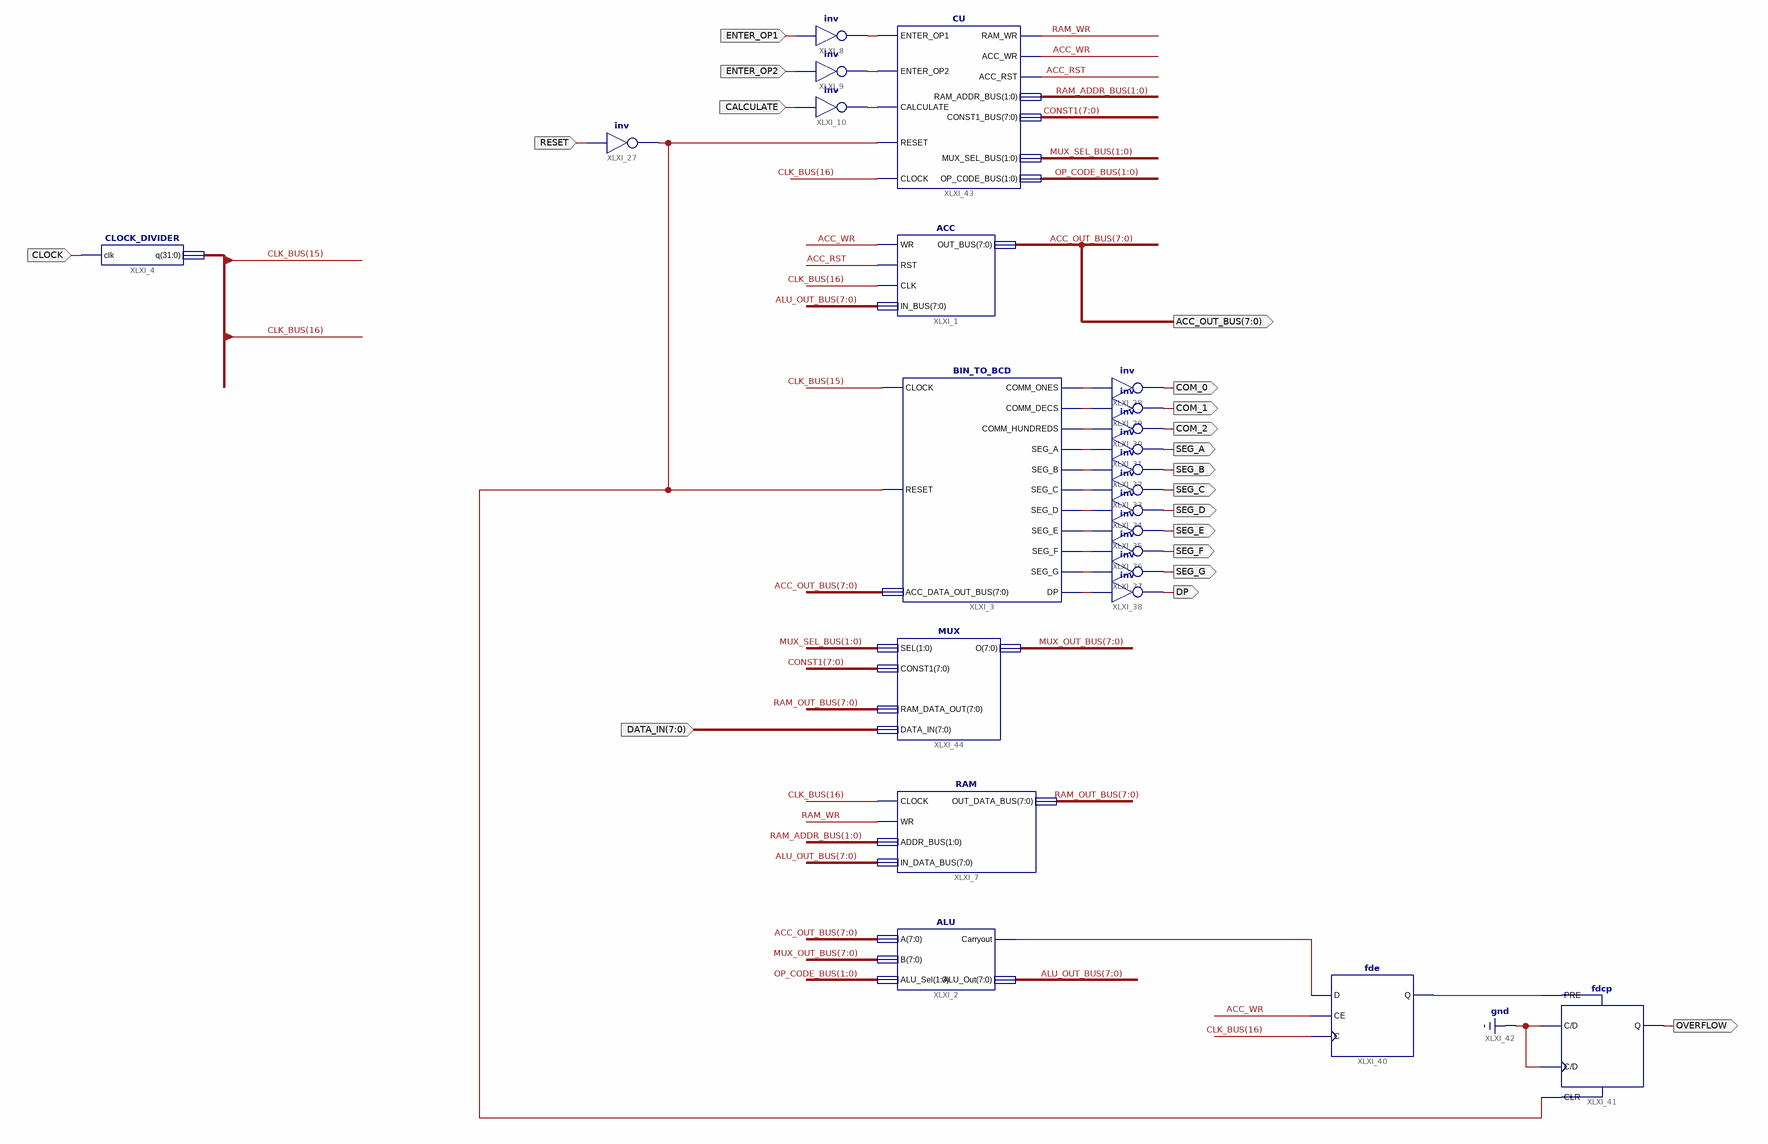
[diagram p0: schematic sheet 1]
// Xilinx ISE schematic TOP_SCHEME.sch (spartan3a) as structural Verilog: 24 symbols, 19 ports
module TOP_SCHEME (
  input  CLOCK,
  input  RESET,
  input  ENTER_OP1,
  input  ENTER_OP2,
  input  CALCULATE,
  input  [7:0] DATA_IN,
  output [7:0] ACC_OUT_BUS,
  output COM_0,
  output COM_1,
  output COM_2,
  output SEG_A,
  output SEG_B,
  output SEG_C,
  output SEG_D,
  output SEG_E,
  output SEG_F,
  output SEG_G,
  output DP,
  output OVERFLOW
);

  wire ACC_RST, ACC_WR, RAM_WR, XLXN_5, XLXN_6, XLXN_7, XLXN_40, XLXN_42, XLXN_43, XLXN_44, XLXN_45, XLXN_46,
       XLXN_47, XLXN_48, XLXN_49, XLXN_50, XLXN_51, XLXN_52, XLXN_81, XLXN_87;
  wire [1:0] MUX_SEL_BUS, OP_CODE_BUS, RAM_ADDR_BUS;
  wire [7:0] ALU_OUT_BUS, CONST1, MUX_OUT_BUS, RAM_OUT_BUS;
  wire [31:0] CLK_BUS;

  ACC XLXI_1 (.WR(ACC_WR), .RST(ACC_RST), .CLK(CLK_BUS[16]), .IN_BUS(ALU_OUT_BUS), .OUT_BUS(ACC_OUT_BUS));
  ALU XLXI_2 (.A(ACC_OUT_BUS), .B(MUX_OUT_BUS), .ALU_Sel(OP_CODE_BUS), .Carryout(XLXN_81), .ALU_Out(ALU_OUT_BUS));
  BIN_TO_BCD XLXI_3 (
    .CLOCK(CLK_BUS[15]), .RESET(XLXN_40), .ACC_DATA_OUT_BUS(ACC_OUT_BUS), .COMM_ONES(XLXN_42),
    .COMM_DECS(XLXN_43), .COMM_HUNDREDS(XLXN_44), .SEG_A(XLXN_45), .SEG_B(XLXN_46), .SEG_C(XLXN_47),
    .SEG_D(XLXN_48), .SEG_E(XLXN_49), .SEG_F(XLXN_50), .SEG_G(XLXN_51), .DP(XLXN_52));
  CLOCK_DIVIDER XLXI_4 (.clk(CLOCK), .q(CLK_BUS));
  RAM XLXI_7 (
    .CLOCK(CLK_BUS[16]), .WR(RAM_WR), .ADDR_BUS(RAM_ADDR_BUS), .IN_DATA_BUS(ALU_OUT_BUS),
    .OUT_DATA_BUS(RAM_OUT_BUS));
  not XLXI_8 (XLXN_5, ENTER_OP1);
  not XLXI_9 (XLXN_6, ENTER_OP2);
  not XLXI_10 (XLXN_7, CALCULATE);
  not XLXI_27 (XLXN_40, RESET);
  not XLXI_28 (COM_0, XLXN_42);
  not XLXI_29 (COM_1, XLXN_43);
  not XLXI_30 (COM_2, XLXN_44);
  not XLXI_31 (SEG_A, XLXN_45);
  not XLXI_32 (SEG_B, XLXN_46);
  not XLXI_33 (SEG_C, XLXN_47);
  not XLXI_34 (SEG_D, XLXN_48);
  not XLXI_35 (SEG_E, XLXN_49);
  not XLXI_36 (SEG_F, XLXN_50);
  not XLXI_37 (SEG_G, XLXN_51);
  not XLXI_38 (DP, XLXN_52);
  fde XLXI_40 (.C(CLK_BUS[16]), .CE(ACC_WR), .D(XLXN_81), .Q(XLXN_87));
  fdcp XLXI_41 (.C(1'b0), .CLR(XLXN_40), .D(1'b0), .PRE(XLXN_87), .Q(OVERFLOW));
  CU XLXI_43 (
    .ENTER_OP1(XLXN_5), .ENTER_OP2(XLXN_6), .CALCULATE(XLXN_7), .RESET(XLXN_40), .CLOCK(CLK_BUS[16]),
    .RAM_WR(RAM_WR), .ACC_WR(ACC_WR), .ACC_RST(ACC_RST), .RAM_ADDR_BUS(RAM_ADDR_BUS), .CONST1_BUS(CONST1),
    .MUX_SEL_BUS(MUX_SEL_BUS), .OP_CODE_BUS(OP_CODE_BUS));
  MUX XLXI_44 (.SEL(MUX_SEL_BUS), .CONST1(CONST1), .RAM_DATA_OUT(RAM_OUT_BUS), .DATA_IN(DATA_IN), .O(MUX_OUT_BUS));
endmodule
